# EAGLE design fabisp (EAGLE 5.11)
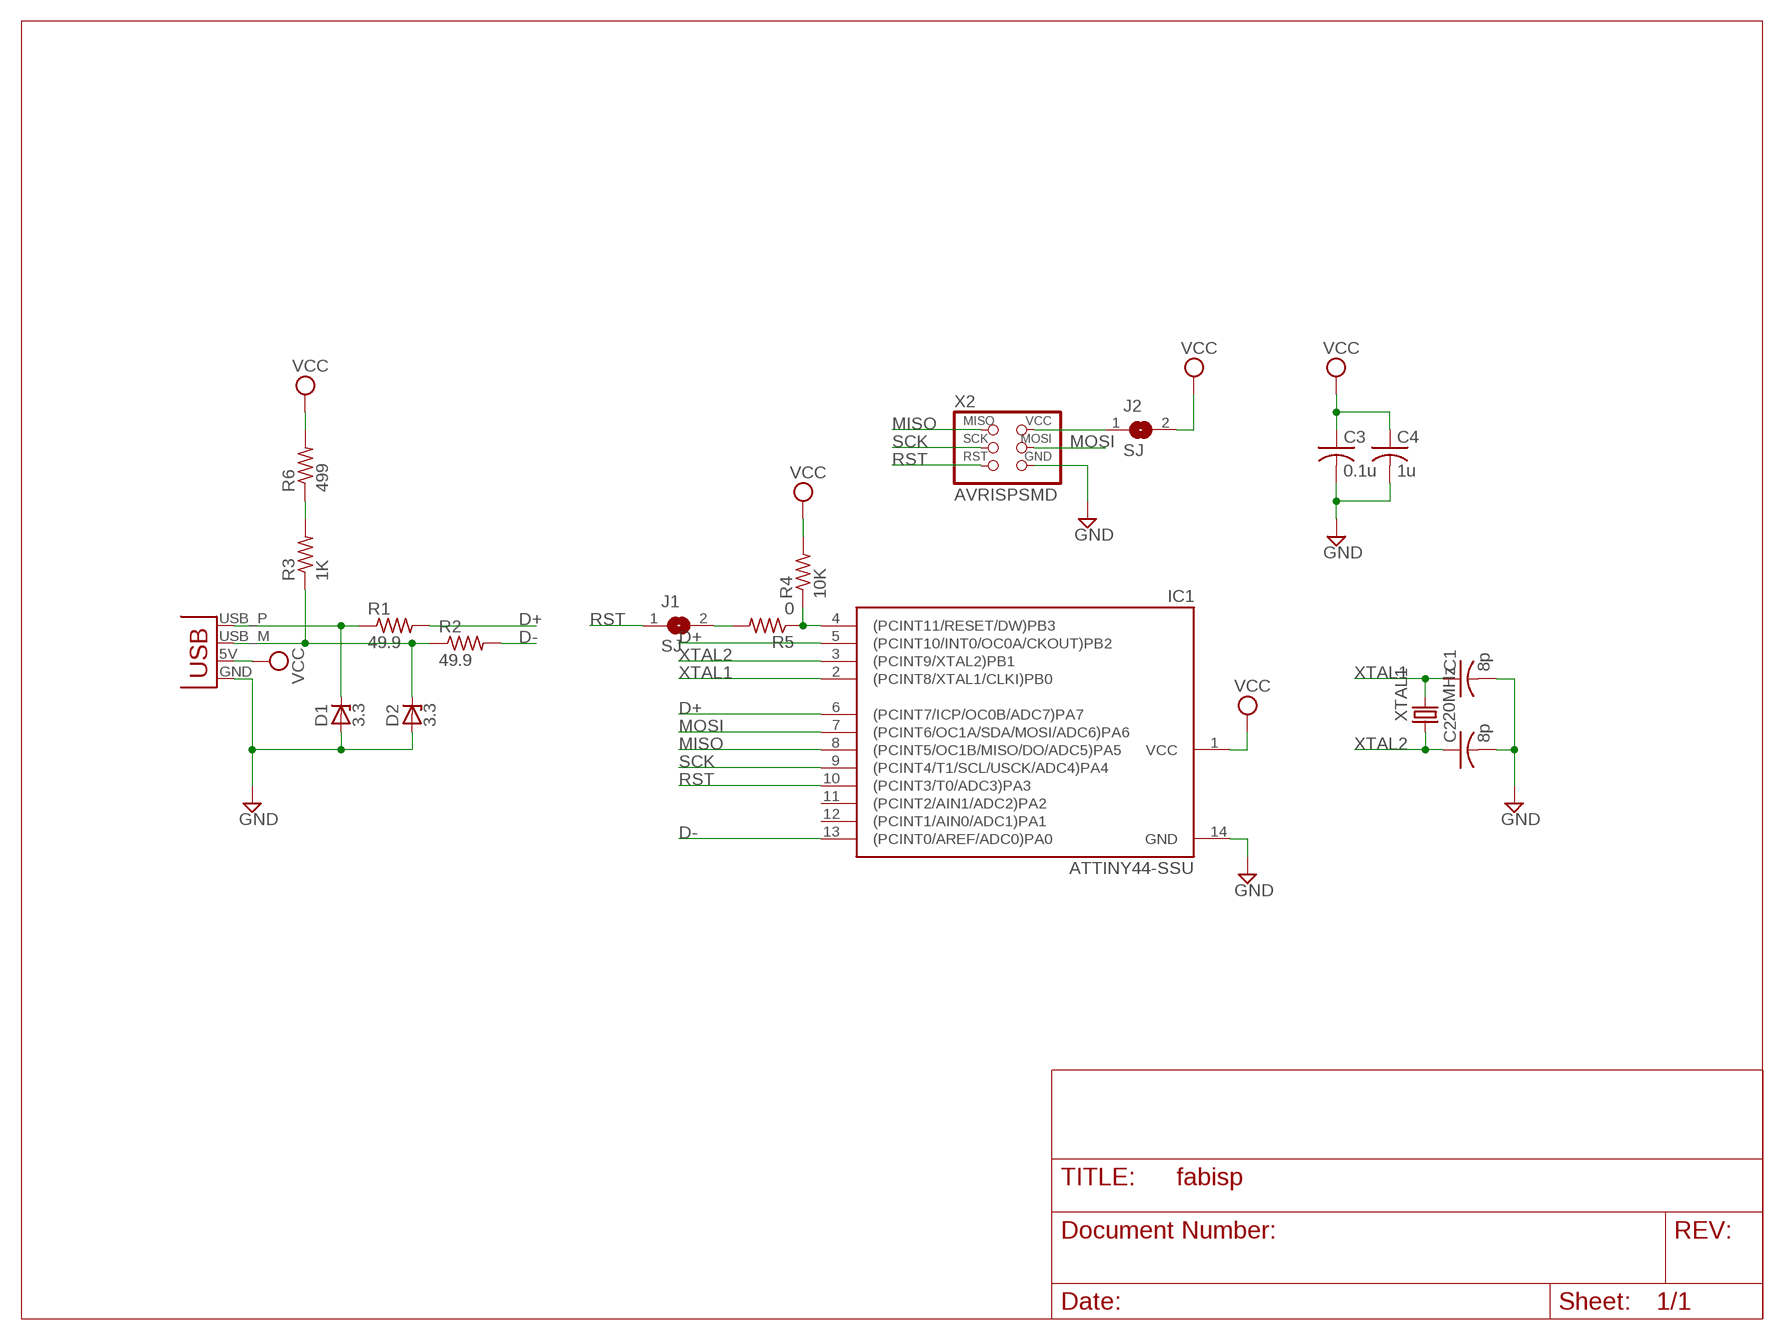
[diagram p0: schematic, sheet 1]

## Parts
C1  8p  C-USC1206  [C1206]
C2  8p  C-USC1206  [C1206]
C3  0.1u  C-USC1206  [C1206]
C4  1u  C-USC1206  [C1206]
D1  3.3  ZENER_DIODESOD123  [SOD123]
D2  3.3  ZENER_DIODESOD123  [SOD123]
IC1  ATTINY44-SSU  [SOIC14]
J1  SJ  SOLDER_JUMPER  [SJFAB]
J2  SJ  SOLDER_JUMPER  [SJFAB]
R1  49.9  R-US_R1206  [R1206]
R2  49.9  R-US_R1206  [R1206]
R3  1K  R-US_R1206  [R1206]
R4  10K  R-US_R1206  [R1206]
R5  0  R-US_R1206  [R1206]
R6  499  R-US_R1206  [R1206]
X1  USBPCB  [USB-A-PCB]
X2  AVRISPSMD  [2X03SMD]
XTAL1  20MHz  CRYSTAL  [2-SMD-5X3MM]

## Nets
D+: IC1.5((PCINT10/INT0/OC0A/CKOUT)PB2) IC1.6((PCINT7/ICP/OC0B/ADC7)PA7) R1.2
D-: IC1.13((PCINT0/AREF/ADC0)PA0) R2.2
GND: C1.2 C2.2 C3.2 C4.2 D1.ANODE D2.ANODE IC1.14(GND) X1.GND X2.6(GND)
MISO: IC1.8((PCINT5/OC1B/MISO/DO/ADC5)PA5) X2.1(MISO)
MOSI: IC1.7((PCINT6/OC1A/SDA/MOSI/ADC6)PA6) X2.4(MOSI)
N$1: D1.CATHODE R1.1 X1.USB_P(D+)
N$2: D2.CATHODE R2.1 R3.1 X1.USB_M(D-)
N$3: J1.2 R5.2
N$4: J2.1 X2.2(VCC)
N$5: IC1.4((PCINT11/RESET/DW)PB3) R4.1 R5.1
N$6: R3.2 R6.1
RST: IC1.10((PCINT3/T0/ADC3)PA3) J1.1 X2.5(RST)
SCK: IC1.9((PCINT4/T1/SCL/USCK/ADC4)PA4) X2.3(SCK)
VCC: C3.1 C4.1 IC1.1(VCC) J2.2 R4.2 R6.2 X1.5V(VBUS)
XTAL1: C1.1 IC1.2((PCINT8/XTAL1/CLKI)PB0) XTAL1.P$2
XTAL2: C2.1 IC1.3((PCINT9/XTAL2)PB1) XTAL1.P$1
Unconnected: IC1.11((PCINT2/AIN1/ADC2)PA2) IC1.12((PCINT1/AIN0/ADC1)PA1)

## Library data of the parts
C1-C4 = rcl:C-US: CAPACITOR, American symbol
D1 D2 = fab:ZENER_DIODE: zener diode
IC1 = fab:ATTINY44
J1 J2 = fab:SOLDER_JUMPER
R1-R6 = rcl:R-US_: RESISTOR, American symbol
X1 = SparkFun:USB: USB Connectors USB-B-PTH is fully proven SKU : PRT-00139 USB-miniB is fully proven SKU : PRT-00587 USB-A-PCB is untested. USB-A-H is throughly reviewed, but untested. Spark Fun Electronics SKU : PRT-00437 USB-B-SMT is throughly reviewed, but untested. Needs silkscreen touching up. USB-A-S has not been used/tested USB-MB-H has not been used/tested
X2 = fab:AVRISP
XTAL1 = fab:CRYSTAL

## Board
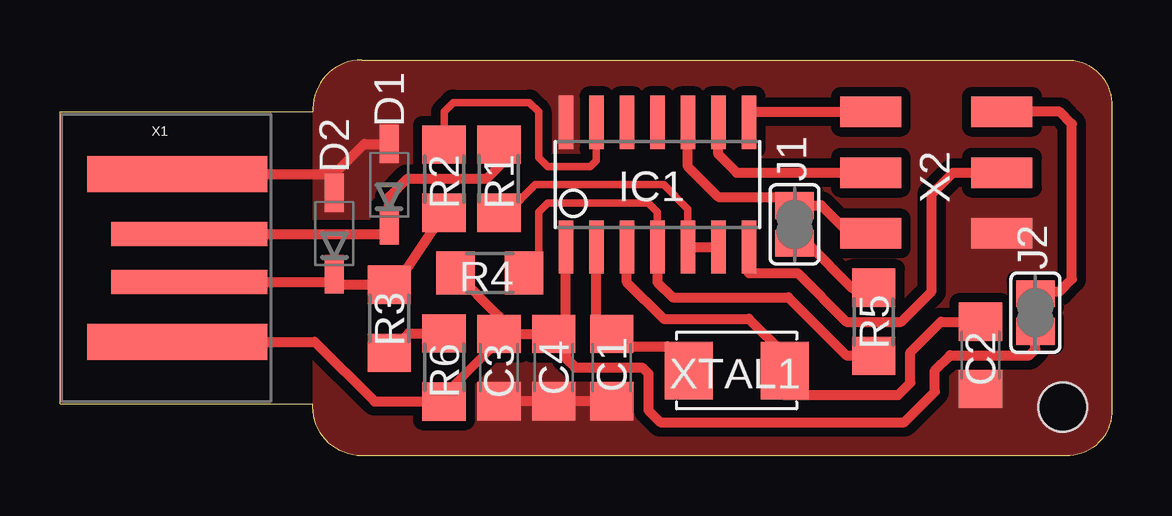
[diagram p1: board, top side]

Size 43.81 x 16.51 mm. Coordinates in mm from the lower left corner, seen from the top.
Outline: 0,2.16 10.54,2.16 10.54,2.03 arc90 12.57,0 41.91,0 arc90 43.81,1.78 43.81,14.73 arc90 41.91,16.51 12.57,16.51 arc90 10.54,14.48 10.54,14.35 0,14.35 0,2.16
Copper layers (1*16): Top 0.035mm / dielectric 1.5mm / Bottom 0.035mm
Design rules "fab": minimum track width 12mil, minimum drill 0.8mm, track to track 15.5mil, track to pad 15.5mil, pad to pad 15mil, via to via 15mil, smd to smd 10mil, copper to edge 0mil, drill to drill 1mm, minimum pad ring 0.2mm, minimum via ring 0.2mm, stop-mask expansion 4mil, vias tented up to drill 0mil, thermal gap 1mm
Holes 2.03 mm at 41.78,2.03
tRestrict: 4 lines

### Footprints (pad centres in the part's own frame; a part is rotated, then mirrored left to right if it is on the bottom)
C1206 = smd 1.6 x 1.8: 1 -1.4,0; 2 1.4,0
SOD123 = smd 1.6 x 0.8: ANODE 1.7,0; CATHODE -1.7,0
SOIC14 = smd 0.61 x 2.21: 1 -3.81,-2.603; 2 -2.54,-2.603; 3 -1.27,-2.603; 4 0,-2.603; 5 1.27,-2.603; 6 2.54,-2.603; 7 3.81,-2.603; 8 3.81,2.603; 9 2.54,2.603; 10 1.27,2.603; 11 0,2.603; 12 -1.27,2.603; 13 -2.54,2.603; 14 -3.81,2.603
SJFAB = smd 1.118 x 1.6: 1 -0.787,0; 2 0.787,0
R1206 = smd 1.6 x 1.803: 1 -1.422,0; 2 1.422,0
USB-A-PCB = smd 7.5 x 1.5: 5V -0.2,-3.5; GND -0.2,3.5 | smd 6.5 x 1: USB_M 0.3,-1; USB_P 0.3,1
2X03SMD = smd 2.54 x 1.27: 1 -2.54,2.54; 2 2.92,2.54; 3 -2.54,0; 4 2.92,0; 5 -2.54,-2.54; 6 2.92,-2.54
2-SMD-5X3MM = smd 2 x 2.4: P$1 -2,0; P$2 2,0

### Placement (x,y rotation side)
C1  22.99,3.68 270 top
C2  38.35,4.19 270 top
C3  18.29,3.68 270 top
C4  20.57,3.68 270 top
D1  13.72,11.3 90 top
D2  11.43,9.27 90 top
IC1  24.89,11.3 0 top
J1  30.61,9.65 270 top
J2  40.64,5.97 270 top
R1  18.29,11.56 270 top
R2  16,11.56 90 top
R3  13.72,5.71 270 top
R4  17.91,7.62 180 top
R5  33.91,5.59 90 top
R6  16,3.68 270 top
X1  5.08,8.26 0 top
X2  36.32,11.81 0 top
XTAL1  28.19,3.56 180 top

### Tracks (layer width: path | path; a pad name or v marks a point on that pad's centre or on a via)
D+
  Top 0.305: 18.64,10.13 19.81,11.3 25.15,11.3 26.16,10.29 IC1.5
  Top 0.406: IC1.5 IC1.6 | R1.2 18.64,10.13
D-
  Top 0.305: IC1.13 22.35,12.32 22.1,12.06 20.32,12.06 19.94,12.45 19.94,14.35 19.56,14.73 16.38,14.73 16,14.35 R2.2
GND
  Top 0.406: X1.GND 11.43,11.76 | 11.43,11.76 D2.ANODE | D1.ANODE 12.68,13 11.43,11.76 | C1.2 C4.2 C3.2
  pour Top (no thermals): 12.57,16.51 41.91,16.51 arc-90 43.81,14.73 43.81,1.78 arc-90 41.91,0 12.57,0 arc-90 10.54,2.03 10.54,14.48 arc-90
MISO
  Top 0.406: IC1.8 28.7,14.35 X2.1
MOSI
  Top 0.406: 28.7,8.51 IC1.7 28.7,7.62 30.73,7.62 32.77,5.59 35.05,5.59 36.32,6.86 36.32,10.92 37.21,11.81 X2.4
N$1
  Top 0.406: D1.CATHODE 13.56,9.76 | X1.USB_P 13.37,9.26 D1.CATHODE | R1.1 18.29,12.06 17.78,11.56 14.48,11.56 13.72,10.79 D1.CATHODE
N$2
  Top 0.406: X1.USB_M 11.11,7.25 D2.CATHODE 11.43,7.14 R3.1 14.02,7.14 R2.1
N$3
  Top 0.406: J1.2 31.14,8.87 33.02,6.99 33.88,6.99 R5.2
N$4
  Top 0.406: 40.92,6.76 J2.1 40.64,6.86 41.66,6.86 42.16,7.37 42.16,13.84 41.66,14.35 X2.2
N$5
  Top 0.305: IC1.4 24.89,10.16 24.51,10.54 20.32,10.54 19.94,10.16 19.94,8.23 R4.1
  Top 0.406: R5.1 33.76,4.19 32.77,4.19 30.35,6.6 25.53,6.6 24.89,7.24 IC1.4
N$6
  Top 0.406: R6.1 14.53,5.11 R3.2
RST
  Top 0.406: IC1.10 26.16,12.06 27.43,10.79 30,10.79 J1.1 31.73,10.44 32.89,9.27 X2.5
SCK
  Top 0.406: IC1.9 27.43,12.57 28.19,11.81 X2.3
VCC
  Top 0.381: 16,2.54 17.91,4.45
  Top 0.406: 21.08,5.59 IC1.1 | 21.08,5.59 C4.1 C3.1 | X1.5V 10.61,4.75 13.11,2.26 R6.2 16,2.54 | R4.2 18.29,5.82 C3.1 | 21.08,5.59 21.08,4.06 21.46,3.68 24.26,3.68 24.51,3.43 24.51,1.91 25.02,1.4 35.18,1.4 36.45,2.67 36.45,3.56 37.08,4.19 40.39,4.19 40.64,4.45 J2.2 | 17.91,4.45 17.91,4.7 C3.1
XTAL1
  Top 0.406: IC1.2 22.35,5.72 C1.1 23.24,5.08 23.75,4.57 25.3,4.57 XTAL1.P$2
XTAL2
  Top 0.406: IC1.3 23.62,7.24 25.15,5.71 28.7,5.71 30.19,4.22 XTAL1.P$1 30.19,2.54 34.92,2.54 35.43,3.05 35.43,4.32 36.71,5.59 C2.1